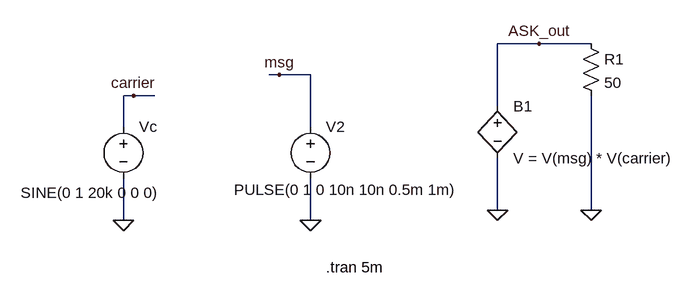
[diagram p0: schematic exp10_ask.asc]
exp10_ask.asc, the LTspice schematic file:
Version 4.1
SHEET 1 908 680
WIRE 672 -64 608 -64
WIRE 752 -64 672 -64
WIRE 272 -16 256 -16
WIRE 320 -16 272 -16
WIRE 48 16 32 16
WIRE 80 16 48 16
WIRE 608 32 608 -64
WIRE 32 64 32 16
WIRE 320 64 320 -16
WIRE 608 192 608 112
WIRE 752 192 752 16
WIRE 32 208 32 144
WIRE 320 208 320 144
FLAG 32 208 0
FLAG 320 208 0
FLAG 48 16 carrier
FLAG 272 -16 msg
FLAG 608 192 0
FLAG 752 192 0
FLAG 672 -64 ASK_out
SYMBOL voltage 32 48 R0
WINDOW 3 -158 117 Left 2
WINDOW 123 0 0 Left 0
WINDOW 39 0 0 Left 0
SYMATTR InstName Vc
SYMATTR Value SINE(0 1 20k 0 0 0)
SYMBOL voltage 320 48 R0
WINDOW 3 -118 113 Left 2
WINDOW 123 0 0 Left 0
WINDOW 39 0 0 Left 0
SYMATTR InstName V2
SYMATTR Value PULSE(0 1 0 10n 10n 0.5m 1m)
SYMBOL bv 608 16 R0
SYMATTR InstName B1
SYMATTR Value V = V(msg) * V(carrier)
SYMBOL res 736 -80 R0
SYMATTR InstName R1
SYMATTR Value 50
TEXT 344 280 Left 2 !.tran 5m

The netlist it stands for:
* exp10_ask.asc
Vc carrier 0 SINE(0 1 20k 0 0 0)
V2 msg 0 PULSE(0 1 0 10n 10n 0.5m 1m)
B1 ASK_out 0 V = V(msg) * V(carrier)
R1 ASK_out 0 50
.tran 5m
.backanno
.end